# EAGLE design Fuente (EAGLE 7.6.0)
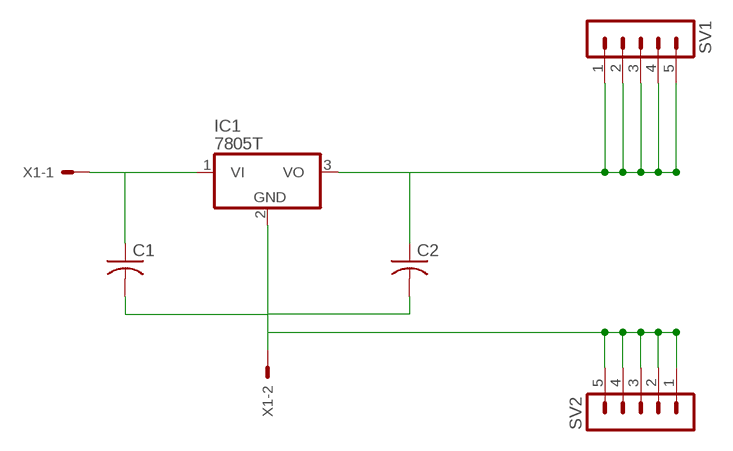
[diagram p0: schematic, sheet 1]

## Parts
C1  C-US025-030X050  [C025-030X050]
C2  C-US025-030X050  [C025-030X050]
IC1  7805T  [TO220H]
SV1  MA05-1  [MA05-1]
SV2  MA05-1  [MA05-1]
X1  KK-156-2  [KK-156-2]

## Nets
N$1: C1.1 IC1.1(VI) X1.1
N$2: C2.1 IC1.3(VO) SV1.1 SV1.2 SV1.3 SV1.4 SV1.5
N$3: C1.2 C2.2 IC1.2(GND) SV2.1 SV2.2 SV2.3 SV2.4 SV2.5 X1.2

## Library data of the parts
C1 C2 = rcl:C-US: CAPACITOR, American symbol
IC1 = linear:78*: Positive VOLTAGE REGULATOR Source: http://cache.national.com/ds/LM/LM78L05.pdf http://www.fairchildsemi.com/ds/LM/LM7805.pdf
SV1 SV2 = con-lstb:MA05-1: PIN HEADER; OC_FARNELL: unknown; OC_NEWARK: unknown
X1 = con-molex:KK-156-2: KK 156 HEADER Source: http://www.molex.com/pdm_docs/sd/026604100_sd.pdf; OC_FARNELL: unknown; OC_NEWARK: unknown

## Board
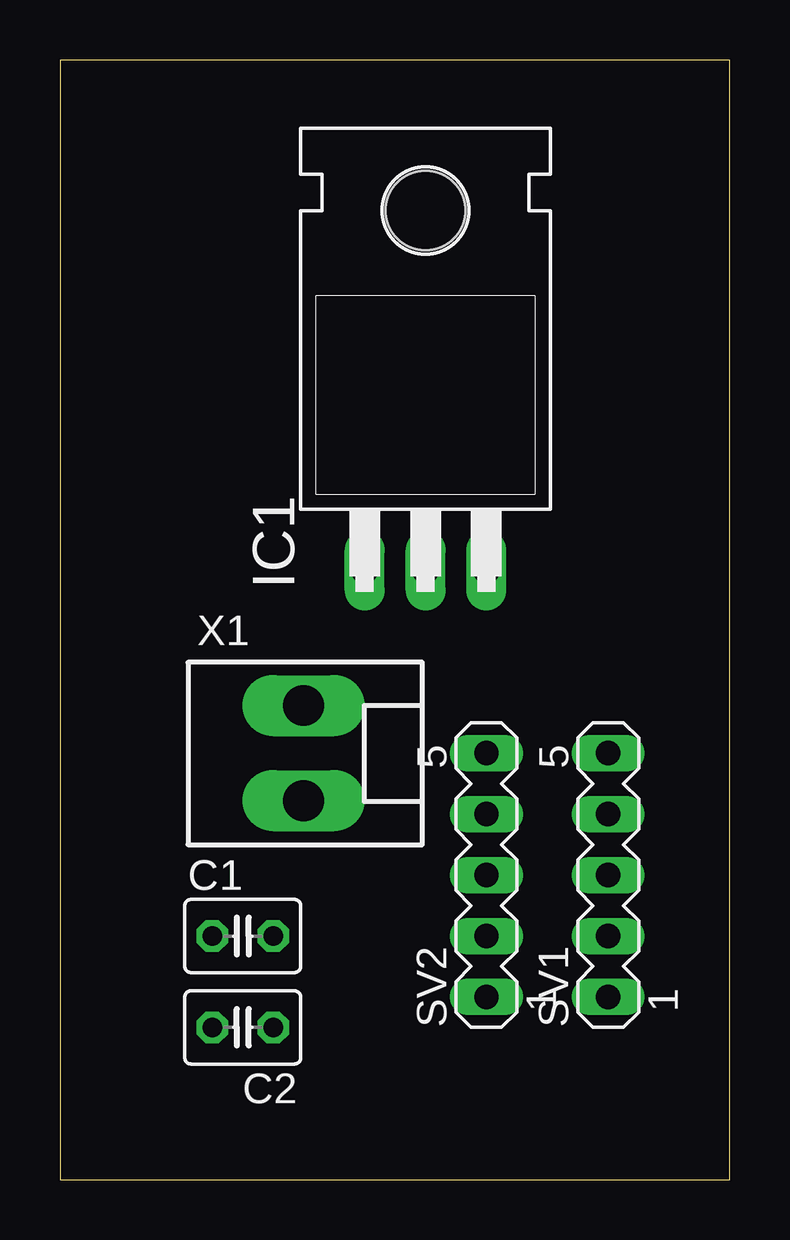
[diagram p1: board, top side]
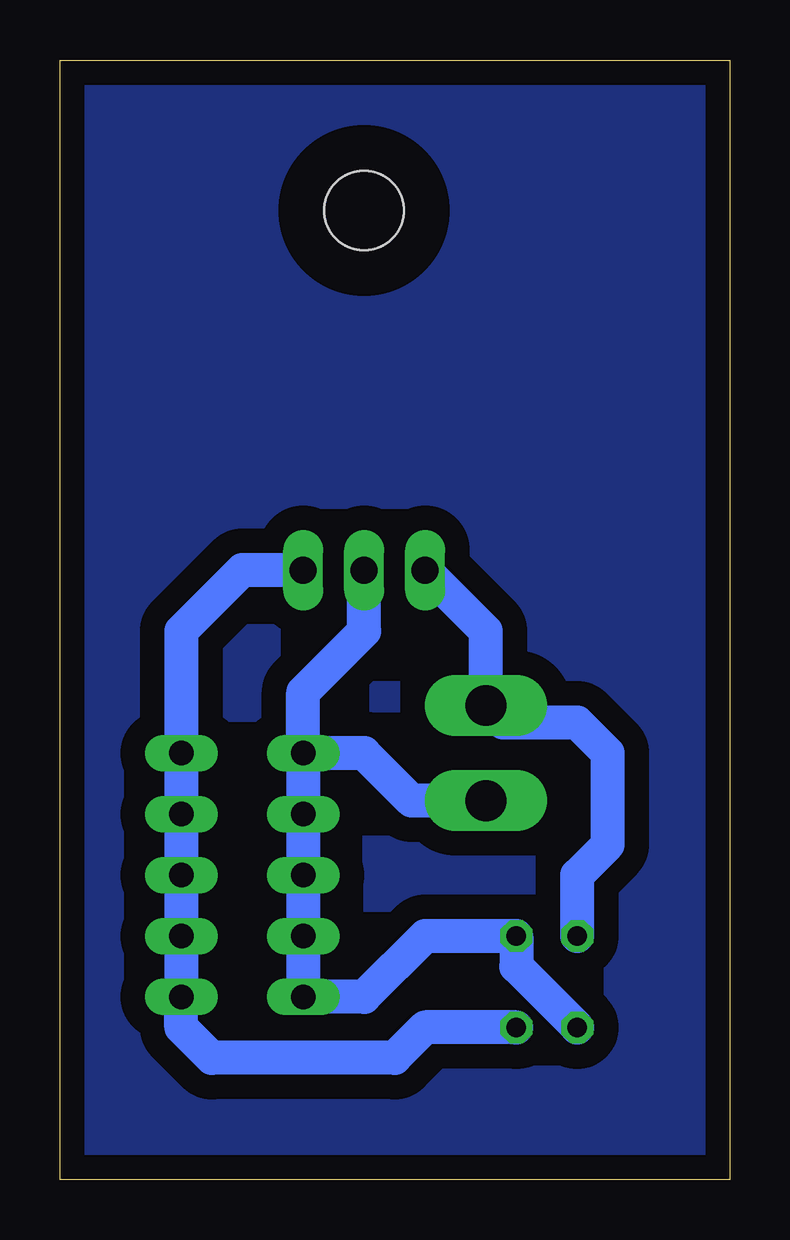
[diagram p2: board, bottom side, seen from below]

Size 27.92 x 46.66 mm. Coordinates in mm from the lower left corner, seen from the top.
Outline: 0,0 27.92,0 27.92,46.66 0,46.66 0,0
Copper layers (1*16): Top 0.035mm / dielectric 1.5mm / Bottom 0.035mm
Design rules "default": minimum track width 10mil, minimum drill 24mil, track to track 8mil, track to pad 8mil, pad to pad 8mil, via to via 8mil, smd to smd 8mil, copper to edge 40mil, drill to drill 8mil, minimum pad ring 10mil, minimum via ring 8mil, stop-mask expansion 4mil, vias tented up to drill 0mil, thermal gap 10mil

### Footprints (pad centres in the part's own frame; a part is rotated, then mirrored left to right if it is on the bottom)
C025-030X050 = drill 0.813 octagon: 1 -1.27,0; 2 1.27,0
TO220H = drill 1.118 long: 1 -2.54,-10.16; 2 0,-10.16; 3 2.54,-10.16 | hole 3.302: 0,4.826
MA05-1 = drill 1.016 long: 1 -5.08,0; 2 -2.54,0; 3 0,0; 4 2.54,0; 5 5.08,0
KK-156-2 = drill 1.7 pad 2.184 long: 1 -1.98,0; 2 1.98,0

### Placement (x,y rotation side)
C1  7.62,10.16 0 top
C2  7.62,6.35 180 top
IC1  15.24,35.56 0 top
SV1  22.86,12.7 90 top
SV2  17.78,12.7 90 top
X1  10.16,17.78 270 top

### Tracks (layer width: path | path; a pad name or v marks a point on that pad's centre or on a via)
N$1
  Bottom 1.422: C1.1 6.35,12.7 5.08,13.97 5.08,17.78 6.35,19.05 9.45,19.05 X1.1 10.16,22.86 IC1.1
N$2
  Bottom 1.422: IC1.3 20.32,25.4 22.86,22.86 SV1.5 SV1.4 SV1.3 SV1.2 SV1.1 22.86,6.35 21.59,5.08 13.97,5.08 12.7,6.35 C2.1
N$3
  Bottom 1.422: SV2.5 SV2.4 SV2.3 SV2.2 SV2.1 15.24,7.62 12.7,10.16 C1.2 8.89,8.89 C2.2 | X1.2 13.26,15.8 15.24,17.78 SV2.5 | SV2.5 17.78,20.32 15.24,22.86 IC1.2
N$4
  pour Bottom (isolate 1.016): 0,0 0,46.99 27.94,46.99 27.94,0